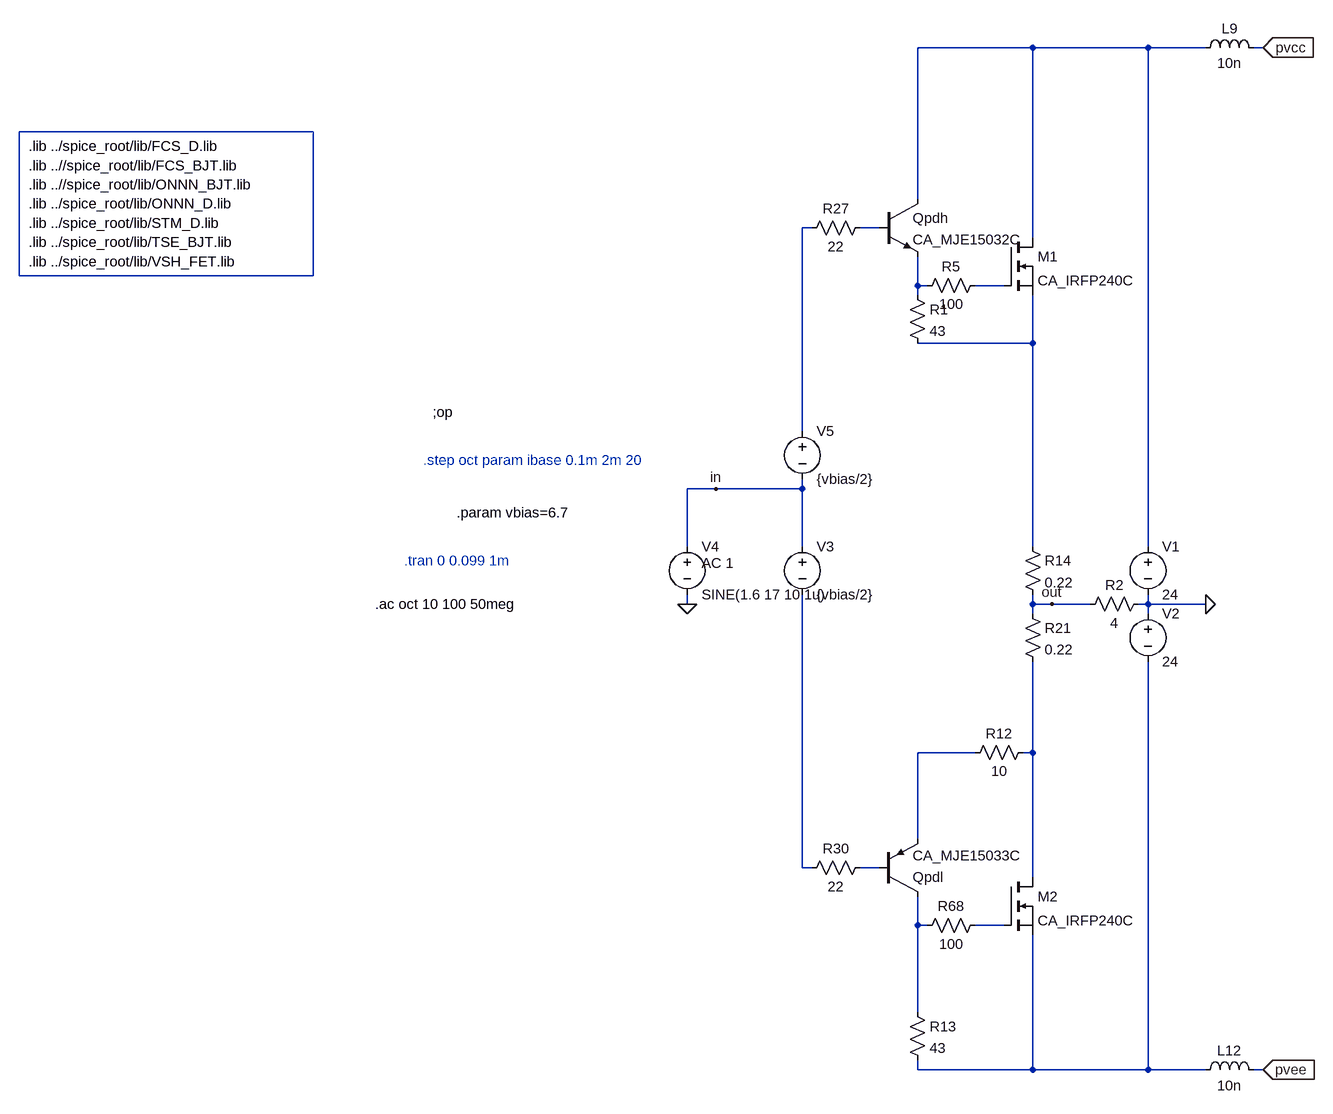
[diagram p0: schematic pab3bbb-compact-ops.asc]
pab3bbb-compact-ops.asc, the LTspice schematic file:
Version 4
SHEET 1 6124 2336
WIRE 1824 -1280 1632 -1280
WIRE 2016 -1280 1824 -1280
WIRE 2112 -1280 2016 -1280
WIRE 2208 -1280 2192 -1280
WIRE 1632 -944 1632 -1280
WIRE 1456 -896 1440 -896
WIRE 1568 -896 1536 -896
WIRE 1824 -880 1824 -1280
WIRE 1632 -800 1632 -848
WIRE 1648 -800 1632 -800
WIRE 1776 -800 1728 -800
WIRE 1632 -784 1632 -800
WIRE 1824 -704 1824 -784
WIRE 1824 -704 1632 -704
WIRE 1440 -512 1440 -896
WIRE 1296 -416 1248 -416
WIRE 1440 -416 1440 -432
WIRE 1440 -416 1296 -416
WIRE 1248 -320 1248 -416
WIRE 1440 -320 1440 -416
WIRE 1824 -320 1824 -704
WIRE 2016 -320 2016 -1280
WIRE 1248 -224 1248 -240
WIRE 1824 -224 1824 -240
WIRE 1856 -224 1824 -224
WIRE 1920 -224 1856 -224
WIRE 2016 -224 2016 -240
WIRE 2016 -224 2000 -224
WIRE 2112 -224 2016 -224
WIRE 1824 -208 1824 -224
WIRE 2016 -208 2016 -224
WIRE 1728 160 1632 160
WIRE 1824 160 1824 -128
WIRE 1824 160 1808 160
WIRE 1632 304 1632 160
WIRE 1440 352 1440 -240
WIRE 1456 352 1440 352
WIRE 1568 352 1536 352
WIRE 1824 368 1824 160
WIRE 1632 448 1632 400
WIRE 1648 448 1632 448
WIRE 1776 448 1728 448
WIRE 1632 736 1632 448
WIRE 1632 832 1632 816
WIRE 1824 832 1824 464
WIRE 1824 832 1632 832
WIRE 2016 832 2016 -128
WIRE 2016 832 1824 832
WIRE 2112 832 2016 832
WIRE 2208 832 2192 832
FLAG 2208 -1280 pvcc
IOPIN 2208 -1280 In
FLAG 2208 832 pvee
IOPIN 2208 832 In
FLAG 2112 -224 0
FLAG 1248 -224 0
FLAG 1856 -224 out
FLAG 1296 -416 in
SYMBOL res 1552 -912 R90
WINDOW 0 0 56 VBottom 2
WINDOW 3 32 56 VTop 2
SYMATTR InstName R27
SYMATTR Value 22
SYMBOL res 1552 336 R90
WINDOW 0 0 56 VBottom 2
WINDOW 3 32 56 VTop 2
SYMATTR InstName R30
SYMATTR Value 22
SYMBOL res 1744 -816 R90
WINDOW 0 0 56 VBottom 2
WINDOW 3 32 56 VTop 2
SYMATTR InstName R5
SYMATTR Value 100
SYMBOL res 1744 432 R90
WINDOW 0 0 56 VBottom 2
WINDOW 3 32 56 VTop 2
SYMATTR InstName R68
SYMATTR Value 100
SYMBOL res 1808 -336 R0
SYMATTR InstName R14
SYMATTR Value 0.22
SYMBOL res 1808 -224 R0
SYMATTR InstName R21
SYMATTR Value 0.22
SYMBOL ind 2096 -1264 R270
WINDOW 0 32 56 VTop 2
WINDOW 3 5 56 VBottom 2
SYMATTR InstName L9
SYMATTR Value 10n
SYMATTR SpiceLine Rser=10m
SYMBOL ind 2096 848 R270
WINDOW 0 32 56 VTop 2
WINDOW 3 5 56 VBottom 2
SYMATTR InstName L12
SYMATTR Value 10n
SYMATTR SpiceLine Rser=10m
SYMBOL npn 1568 -944 R0
SYMATTR InstName Qpdh
SYMATTR Value CA_MJE15032C
SYMBOL pnp 1568 400 M180
SYMATTR InstName Qpdl
SYMATTR Value CA_MJE15033C
SYMBOL res 1616 -800 R0
SYMATTR InstName R1
SYMATTR Value 43
SYMBOL res 1824 144 R90
WINDOW 0 0 56 VBottom 2
WINDOW 3 32 56 VTop 2
SYMATTR InstName R12
SYMATTR Value 10
SYMBOL res 1616 720 R0
SYMATTR InstName R13
SYMATTR Value 43
SYMBOL voltage 2016 -336 R0
WINDOW 123 0 0 Left 0
WINDOW 39 0 0 Left 0
SYMATTR InstName V1
SYMATTR Value 24
SYMBOL voltage 2016 -224 R0
WINDOW 123 0 0 Left 0
WINDOW 39 0 0 Left 0
SYMATTR InstName V2
SYMATTR Value 24
SYMBOL res 2016 -240 R90
WINDOW 0 0 56 VBottom 2
WINDOW 3 32 56 VTop 2
SYMATTR InstName R2
SYMATTR Value 4
SYMBOL voltage 1440 -336 R0
WINDOW 123 0 0 Left 0
WINDOW 39 0 0 Left 0
SYMATTR InstName V3
SYMATTR Value {vbias/2}
SYMBOL voltage 1248 -336 R0
WINDOW 123 24 44 Left 2
WINDOW 39 0 0 Left 0
SYMATTR Value2 AC 1
SYMATTR InstName V4
SYMATTR Value SINE(1.6 17 10 1u)
SYMBOL voltage 1440 -528 R0
WINDOW 123 0 0 Left 0
WINDOW 39 0 0 Left 0
SYMATTR InstName V5
SYMATTR Value {vbias/2}
SYMBOL nmos 1776 -880 R0
SYMATTR InstName M1
SYMATTR Value CA_IRFP240C
SYMBOL nmos 1776 368 R0
SYMATTR InstName M2
SYMATTR Value CA_IRFP240C
TEXT -1376 -968 Left 2 !.lib ..//spice_root/lib/ONNN_BJT.lib
TEXT -1376 -904 Left 2 !.lib ../spice_root/lib/STM_D.lib
TEXT -1376 -1000 Left 2 !.lib ..//spice_root/lib/FCS_BJT.lib
TEXT -1376 -1032 Left 2 !.lib ../spice_root/lib/FCS_D.lib
TEXT -1376 -936 Left 2 !.lib ../spice_root/lib/ONNN_D.lib
TEXT -1376 -872 Left 2 !.lib ../spice_root/lib/TSE_BJT.lib
TEXT 808 -464 Left 2 ;.step oct param ibase 0.1m 2m 20
TEXT 824 -544 Left 2 !;op
TEXT 864 -376 Left 2 !.param vbias=6.7
TEXT 776 -296 Left 2 ;.tran 0 0.099 1m
TEXT 728 -224 Left 2 !.ac oct 10 100 50meg
TEXT -1376 -840 Left 2 !.lib ../spice_root/lib/VSH_FET.lib
RECTANGLE Normal -720 -816 -1392 -1056

The netlist it stands for:
* pab3bbb-compact-ops.asc
R27 N003 N002 22
R30 N010 N009 22
R5 N005 N004 100
R68 N012 N011 100
R14 N006 out 0.22
R21 out N008 0.22
L9 N001 pvcc 10n Rser=10m
L12 N013 pvee 10n Rser=10m
Qpdh N001 N003 N004 0 CA_MJE15032C
Qpdl N011 N010 N007 0 CA_MJE15033C
R1 N004 N006 43
R12 N008 N007 10
R13 N011 N013 43
V1 N001 0 24
V2 0 N013 24
R2 0 out 4
V3 in N009 {vbias/2}
V4 in 0 SINE(1.6 17 10 1u) AC 1
V5 N002 in {vbias/2}
M1 N001 N005 N006 N006 CA_IRFP240C
M2 N008 N012 N013 N013 CA_IRFP240C
.model NPN NPN
.model PNP PNP
.lib standard.bjt
.model NMOS NMOS
.model PMOS PMOS
.lib standard.mos
.lib ..//spice_root/lib/ONNN_BJT.lib
.lib ../spice_root/lib/STM_D.lib
.lib ..//spice_root/lib/FCS_BJT.lib
.lib ../spice_root/lib/FCS_D.lib
.lib ../spice_root/lib/ONNN_D.lib
.lib ../spice_root/lib/TSE_BJT.lib
* .step oct param ibase 0.1m 2m 20
;op
.param vbias=6.7
* .tran 0 0.099 1m
.ac oct 10 100 50meg
.lib ../spice_root/lib/VSH_FET.lib
.backanno
.end